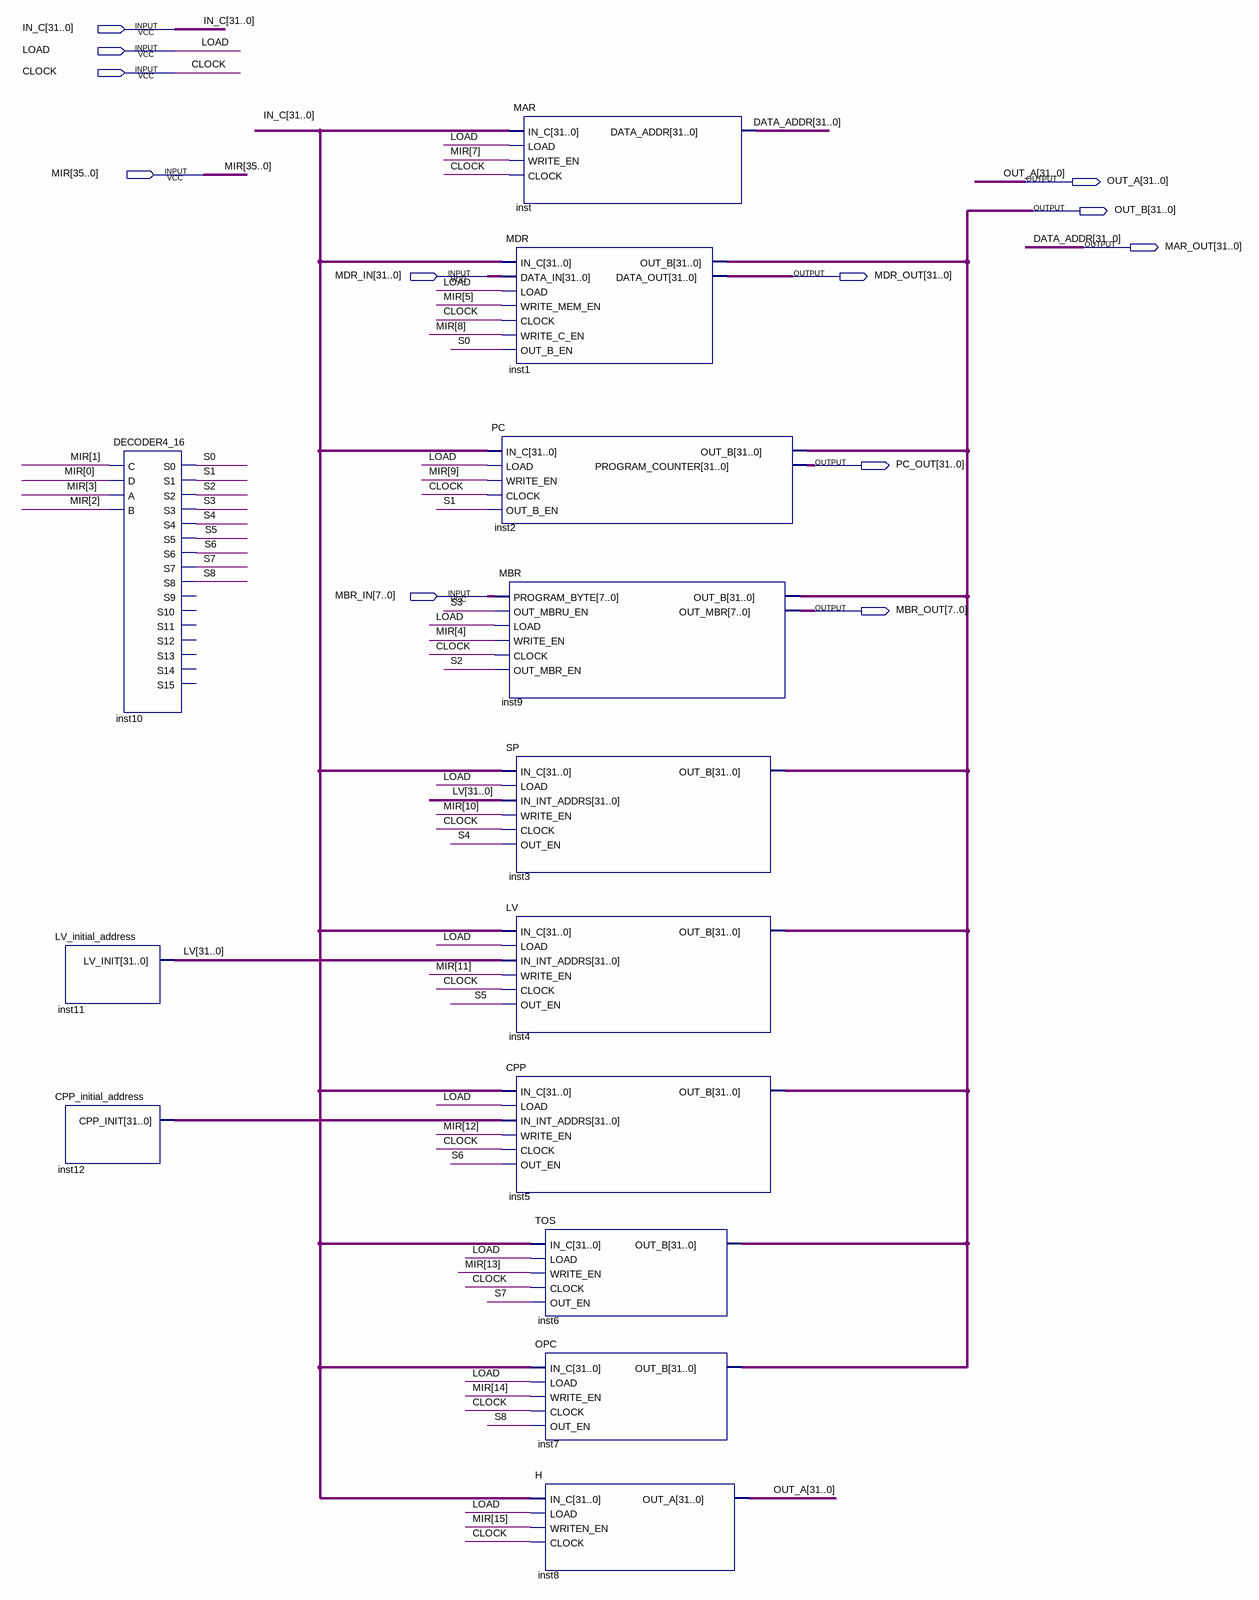
[diagram p0: schematic sheet]
// Quartus schematic BANK.bdf as structural Verilog: 13 symbols, 12 pins
module BANK (
  input  [31:0] IN_C,
  input  LOAD,
  input  CLOCK,
  input  [35:0] MIR,
  input  [31:0] MDR_IN,
  input  [7:0] MBR_IN,
  output [31:0] OUT_A,
  output [31:0] OUT_B,
  output [31:0] MAR_OUT,
  output [31:0] MDR_OUT,
  output [31:0] PC_OUT,
  output [7:0] MBR_OUT
);

  wire S0, S1, S2, S3, S4, S5, S6, S7, S8;
  wire [31:0] inst12_cpp_init, LV;

  LV_initial_address inst11 (.LV_INIT(LV));
  CPP_initial_address inst12 (.CPP_INIT(inst12_cpp_init));
  DECODER4_16 inst10 (
    .C(MIR[1]), .D(MIR[0]), .A(MIR[3]), .B(MIR[2]), .S0(S0), .S1(S1), .S2(S2), .S3(S3), .S4(S4), .S5(S5),
    .S6(S6), .S7(S7), .S8(S8));  // open: S9, S10, S11, S12, S13, S14, S15
  PC inst2 (
    .IN_C(IN_C), .LOAD(LOAD), .WRITE_EN(MIR[9]), .CLOCK(CLOCK), .OUT_B_EN(S1), .OUT_B(OUT_B),
    .PROGRAM_COUNTER(PC_OUT));
  MBR inst9 (
    .PROGRAM_BYTE(MBR_IN), .OUT_MBRU_EN(S3), .LOAD(LOAD), .WRITE_EN(MIR[4]), .CLOCK(CLOCK), .OUT_MBR_EN(S2),
    .OUT_B(OUT_B), .OUT_MBR(MBR_OUT));
  MAR inst (.IN_C(IN_C), .LOAD(LOAD), .WRITE_EN(MIR[7]), .CLOCK(CLOCK), .DATA_ADDR(MAR_OUT));
  MDR inst1 (
    .IN_C(IN_C), .DATA_IN(MDR_IN), .LOAD(LOAD), .WRITE_MEM_EN(MIR[5]), .CLOCK(CLOCK), .WRITE_C_EN(MIR[8]),
    .OUT_B_EN(S0), .OUT_B(OUT_B), .DATA_OUT(MDR_OUT));
  SP inst3 (.IN_C(IN_C), .LOAD(LOAD), .IN_INT_ADDRS(LV), .WRITE_EN(MIR[10]), .CLOCK(CLOCK), .OUT_EN(S4), .OUT_B(OUT_B));
  LV inst4 (.IN_C(IN_C), .LOAD(LOAD), .IN_INT_ADDRS(LV), .WRITE_EN(MIR[11]), .CLOCK(CLOCK), .OUT_EN(S5), .OUT_B(OUT_B));
  CPP inst5 (
    .IN_C(IN_C), .LOAD(LOAD), .IN_INT_ADDRS(inst12_cpp_init), .WRITE_EN(MIR[12]), .CLOCK(CLOCK), .OUT_EN(S6),
    .OUT_B(OUT_B));
  TOS inst6 (.IN_C(IN_C), .LOAD(LOAD), .WRITE_EN(MIR[13]), .CLOCK(CLOCK), .OUT_EN(S7), .OUT_B(OUT_B));
  OPC inst7 (.IN_C(IN_C), .LOAD(LOAD), .WRITE_EN(MIR[14]), .CLOCK(CLOCK), .OUT_EN(S8), .OUT_B(OUT_B));
  H inst8 (.IN_C(IN_C), .LOAD(LOAD), .WRITEN_EN(MIR[15]), .CLOCK(CLOCK), .OUT_A(OUT_A));

  // Other names for the same wires on the sheet: DATA_ADDR[31:0] = MAR_OUT
endmodule
